# Altium schematic sheet 5V_3V_LDO.SchDoc: 5V and 3.3V Power Supply
size A4; Author: Chawthri K.; Organization: Waterloop; Address1: 200 University Ave W; Address2: Engineering 5, 1104; Address3: Waterloo, ON; Address4: N2L 3G1; Revision: 0; SheetNumber: 1; SheetTotal: 1
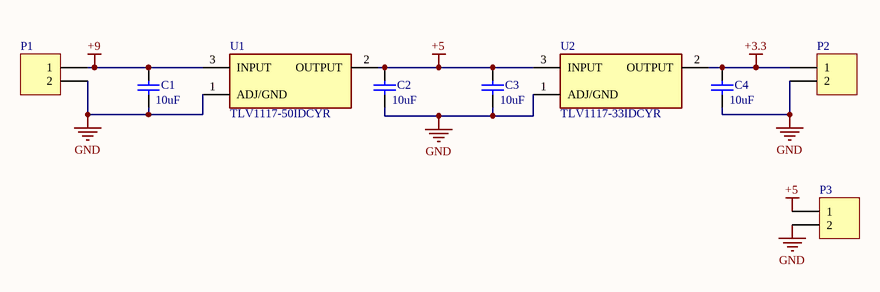
[diagram p0: 5V_3V_LDO.SchDoc]

## Parts
C1  value 10uF  [0805 - Capacitor]  (hidden comment: Capacitor - Nonpolarized)
C2  value 10uF  [0805 - Capacitor]  (hidden comment: Capacitor - Nonpolarized)
C3  value 10uF  [0805 - Capacitor]  (hidden comment: Capacitor - Nonpolarized)
C4  value 10uF  [0805 - Capacitor]  (hidden comment: Capacitor - Nonpolarized)
P1  1x2 Header  [HDR1X2]  (value not drawn)
P2  1x2 Header  [HDR1X2]  (value not drawn)
P3  1x2 Header  [HDR1X2]  (value not drawn)
U1  TLV1117-50IDCYR  [TLV1117]
U2  TLV1117-33IDCYR  [TLV1117]

## Nets
+3.3: C4.2 P2.1 U2.2(OUTPUT)
+5: C2.2 C3.2 P3.1 U1.2(OUTPUT) U2.3(INPUT)
+9: C1.2 P1.1 U1.3(INPUT)
GND: C1.1 C2.1 C3.1 C4.1 P1.2 P2.2 P3.2 U1.1(ADJ/GND) U2.1(ADJ/GND)

## Notes on the sheet
- Title:
- Size:
- Date:
- A4
- Author:
- Revision:
- Sheet
- of
- File:

## Library data of the parts
C1-C4 = Capacitor - Nonpolarized: Nonpolarized Capacitor; Manufacturer: Yageo; Manufacturer Part Number: CC0805KKX5R8BB106; Supplier Part Number: 311-1869-1-ND; Supplier: *; Rating: *
P1-P3 = 1x2 Header: 1x2 Pin Header
U1 = TLV1117-50IDCYR: Linear Voltage Regulator IC 5V 800MA SOT223-4; Manufacturer: Texas Instruments; Datasheet Link: http://www.ti.com/lit/ds/symlink/tlv1117.pdf?HQS=TI-null-null-digikeymode-df-pf-null-wwe&ts=1590668900314; Manufacturer Part Number: TLV1117-50IDCYR; Digikey Part Number: 296-21115-1-ND; Mouser Part Number: 595-TLV1117-50IDCYR
U2 = TLV1117-33IDCYR: Linear Voltage Regulator IC 3.3V 800MA SOT223-4; Manufacturer: Texas Instruments; Datasheet Link: http://www.ti.com/lit/ds/symlink/tlv1117.pdf?HQS=TI-null-null-digikeymode-df-pf-null-wwe&ts=1590668900314; Manufacturer Part Number: TLV1117-33IDCYR; Digikey Part Number: 296-21112-1-ND; Mouser Part Number: 595-TLV1117-33IDCYR